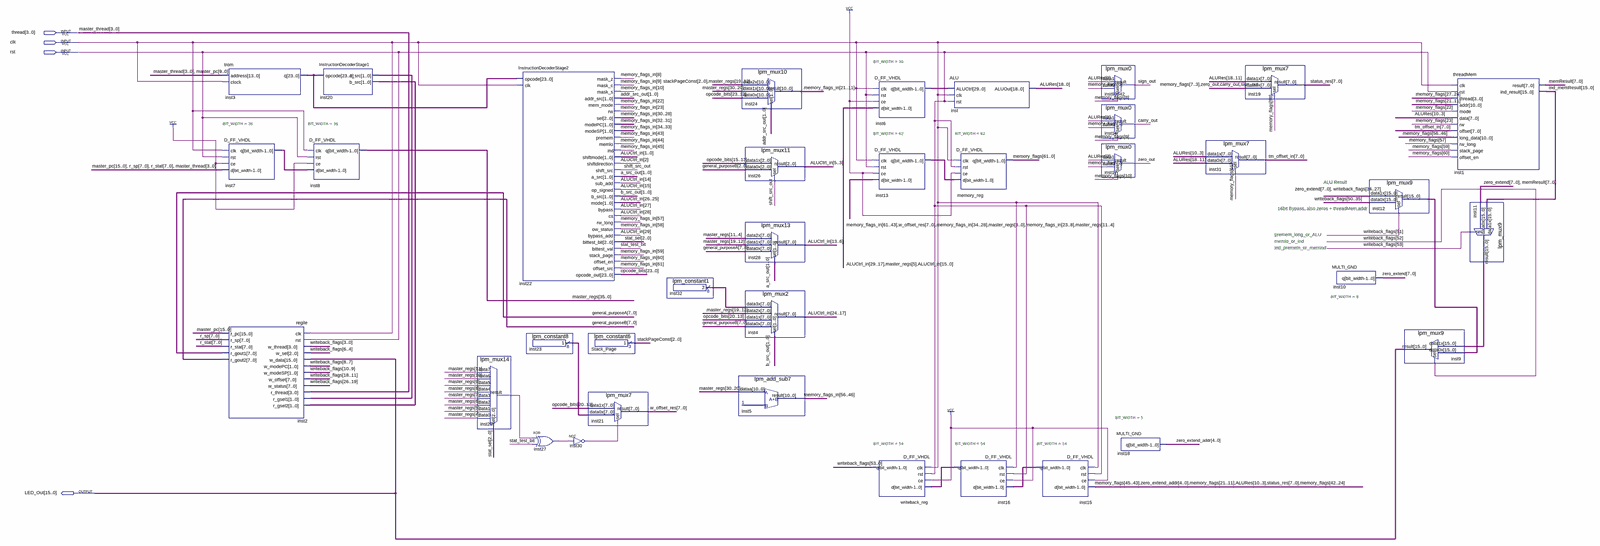
[diagram p0: schematic sheet, whole]
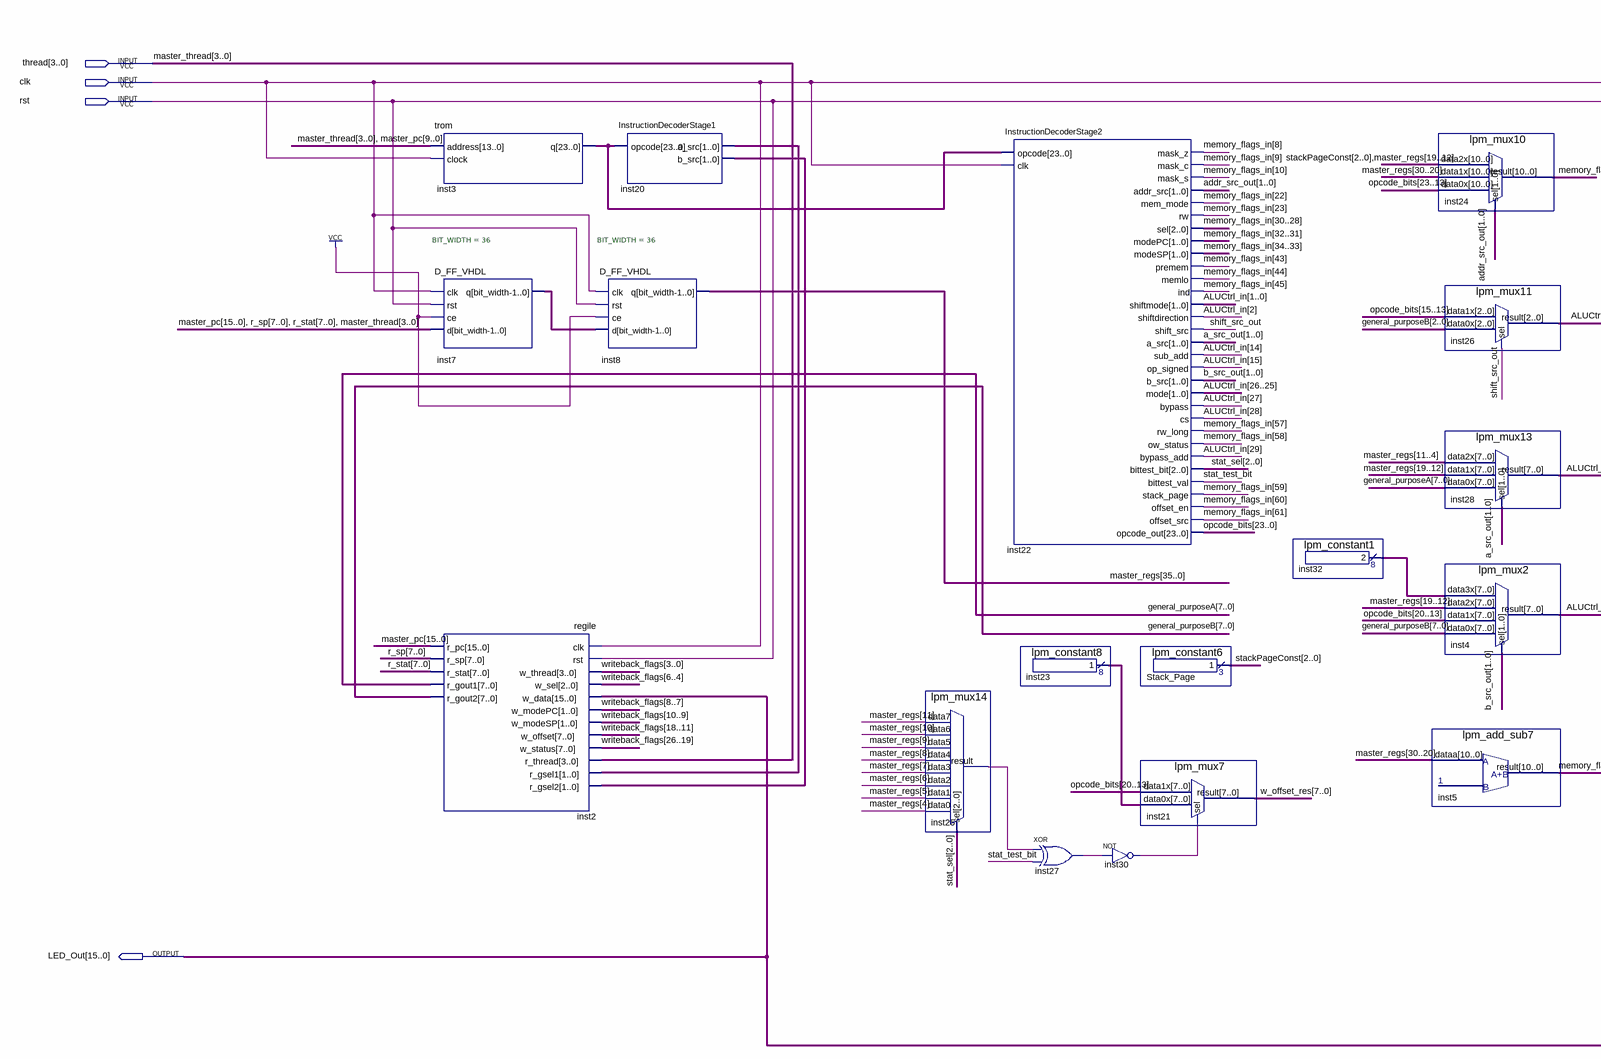
[diagram p1: schematic sheet, left part]
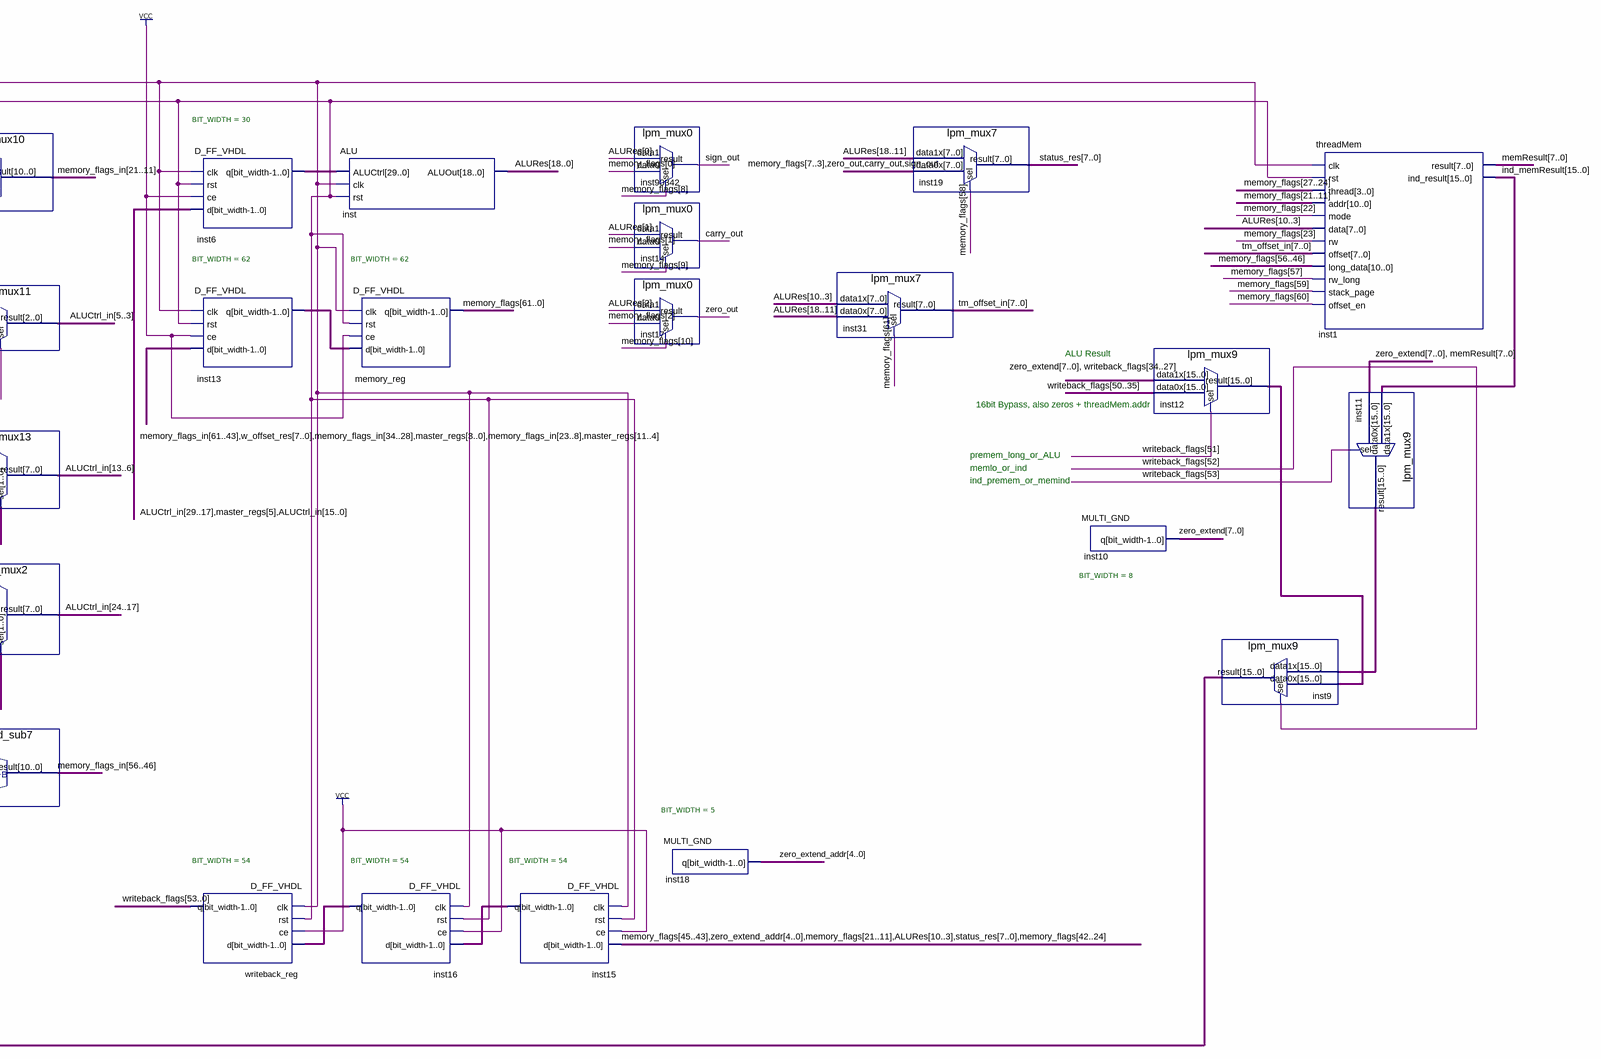
[diagram p2: schematic sheet, right part]
// Quartus schematic core.bdf as structural Verilog: 36 symbols, 4 pins
module core (
  input  [3:0] thread,
  input  clk,
  input  rst,
  output [15:0] LED_Out
);

  wire carry_out, inst25_result, inst27_out, inst30_out, shift_src_out, sign_out, stat_test_bit, zero_out;
  wire [1:0] a_src_out, addr_src_out, b_src_out, inst20_a_src, inst20_b_src;
  wire [2:0] stackPageConst, stat_sel;
  wire [4:0] zero_extend_addr;
  wire [7:0] general_purposeA, general_purposeB, inst23_result, inst32_result, memResult, r_sp, r_stat,
       status_res, tm_offset_in, w_offset_res, zero_extend;
  wire [15:0] ind_memResult, inst11_result, inst12_result, master_pc;
  wire [18:0] ALURes;
  wire [23:0] inst3_q, opcode_bits;
  wire [29:0] ALUCtrl_in, inst6_q;
  wire [35:0] inst7_q, master_regs;
  wire [53:0] inst15_q, inst16_q, writeback_flags;
  wire [61:0] inst13_q, memory_flags;
  wire [61:8] memory_flags_in;

  trom inst3 (.address({thread, master_pc[9:0]}), .clock(clk), .q(inst3_q));
  D_FF_VHDL #(.BIT_WIDTH(36)) inst7 (
    .clk(clk), .rst(rst), .ce(1'b1), .d({master_pc, r_sp, r_stat, thread}), .q(inst7_q));
  regile inst2 (
    .clk(clk), .rst(rst), .w_thread(writeback_flags[3:0]), .w_sel(writeback_flags[6:4]), .w_data(LED_Out),
    .w_modePC(writeback_flags[8:7]), .w_modeSP(writeback_flags[10:9]), .w_offset(writeback_flags[18:11]),
    .w_status(writeback_flags[26:19]), .r_thread(thread), .r_gsel1(inst20_a_src), .r_gsel2(inst20_b_src),
    .r_pc(master_pc), .r_sp(r_sp), .r_stat(r_stat), .r_gout1(general_purposeA), .r_gout2(general_purposeB));
  InstructionDecoderStage1 inst20 (.opcode(inst3_q), .a_src(inst20_a_src), .b_src(inst20_b_src));
  D_FF_VHDL #(.BIT_WIDTH(36)) inst8 (.clk(clk), .rst(rst), .ce(1'b1), .d(inst7_q), .q(master_regs));
  lpm_mux14 inst25 (
    .data7(master_regs[11]), .data6(master_regs[10]), .data5(master_regs[9]), .data4(master_regs[8]),
    .data3(master_regs[7]), .data2(master_regs[6]), .data1(master_regs[5]), .data0(master_regs[4]),
    .sel(stat_sel), .result(inst25_result));
  InstructionDecoderStage2 inst22 (
    .opcode(inst3_q), .clk(clk), .mask_z(memory_flags_in[8]), .mask_c(memory_flags_in[9]),
    .mask_s(memory_flags_in[10]), .addr_src(addr_src_out), .mem_mode(memory_flags_in[22]),
    .rw(memory_flags_in[23]), .sel(memory_flags_in[30:28]), .modePC(memory_flags_in[32:31]),
    .modeSP(memory_flags_in[34:33]), .premem(memory_flags_in[43]), .memlo(memory_flags_in[44]),
    .ind(memory_flags_in[45]), .shiftmode(ALUCtrl_in[1:0]), .shiftdirection(ALUCtrl_in[2]),
    .shift_src(shift_src_out), .a_src(a_src_out), .sub_add(ALUCtrl_in[14]), .op_signed(ALUCtrl_in[15]),
    .b_src(b_src_out), .mode(ALUCtrl_in[26:25]), .bypass(ALUCtrl_in[27]), .cs(ALUCtrl_in[28]),
    .rw_long(memory_flags_in[57]), .ow_status(memory_flags_in[58]), .bypass_add(ALUCtrl_in[29]),
    .bittest_bit(stat_sel), .bittest_val(stat_test_bit), .stack_page(memory_flags_in[59]),
    .offset_en(memory_flags_in[60]), .offset_src(memory_flags_in[61]), .opcode_out(opcode_bits));
  lpm_constant8 inst23 (.result(inst23_result));
  xor inst27 (inst27_out, inst25_result, stat_test_bit);
  lpm_constant6 Stack_Page (.result(stackPageConst));
  lpm_mux7 inst21 (.data1x(opcode_bits[20:13]), .data0x(inst23_result), .sel(inst30_out), .result(w_offset_res));
  not inst30 (inst30_out, inst27_out);
  lpm_constant1 inst32 (.result(inst32_result));
  lpm_mux10 inst24 (
    .data2x({stackPageConst, master_regs[19:12]}), .data1x(master_regs[30:20]), .data0x(opcode_bits[23:13]),
    .sel(addr_src_out), .result(memory_flags_in[21:11]));
  lpm_mux11 inst26 (
    .data1x(opcode_bits[15:13]), .data0x(general_purposeB[2:0]), .sel(shift_src_out), .result(ALUCtrl_in[5:3]));
  lpm_mux13 inst28 (
    .data2x(master_regs[11:4]), .data1x(master_regs[19:12]), .data0x(general_purposeA), .sel(a_src_out),
    .result(ALUCtrl_in[13:6]));
  lpm_mux2 inst4 (
    .data3x(inst32_result), .data2x(master_regs[19:12]), .data1x(opcode_bits[20:13]),
    .data0x(general_purposeB), .sel(b_src_out), .result(ALUCtrl_in[24:17]));
  lpm_add_sub7 inst5 (.dataa(master_regs[30:20]), .result(memory_flags_in[56:46]));
  D_FF_VHDL #(.BIT_WIDTH(30)) inst6 (
    .clk(clk), .rst(rst), .ce(1'b1), .d({ALUCtrl_in[29:17], master_regs[5], ALUCtrl_in[15:0]}), .q(inst6_q));
  D_FF_VHDL #(.BIT_WIDTH(62)) inst13 (
    .clk(clk), .rst(rst), .ce(1'b1),
    .d({memory_flags_in[61:43], w_offset_res, memory_flags_in[34:28], master_regs[3:0], memory_flags_in[23:8], master_regs[11:4]}),
    .q(inst13_q));
  D_FF_VHDL #(.BIT_WIDTH(54)) writeback_reg (.clk(clk), .rst(rst), .ce(1'b1), .d(inst16_q), .q(writeback_flags));
  ALU inst (.ALUCtrl(inst6_q), .clk(clk), .rst(rst), .ALUOut(ALURes));
  D_FF_VHDL #(.BIT_WIDTH(62)) memory_reg (.clk(clk), .rst(rst), .ce(1'b1), .d(inst13_q), .q(memory_flags));
  D_FF_VHDL #(.BIT_WIDTH(54)) inst16 (.clk(clk), .rst(rst), .ce(1'b1), .d(inst15_q), .q(inst16_q));
  D_FF_VHDL #(.BIT_WIDTH(54)) inst15 (
    .clk(clk), .rst(rst), .ce(1'b1),
    .d({memory_flags[45:43], zero_extend_addr, memory_flags[21:11], ALURes[10:3], status_res, memory_flags[42:24]}),
    .q(inst15_q));
  lpm_mux0 inst90342 (.data1(ALURes[0]), .data0(memory_flags[0]), .sel(memory_flags[8]), .result(sign_out));
  lpm_mux0 inst14 (.data1(ALURes[1]), .data0(memory_flags[1]), .sel(memory_flags[9]), .result(carry_out));
  lpm_mux0 inst17 (.data1(ALURes[2]), .data0(memory_flags[2]), .sel(memory_flags[10]), .result(zero_out));
  MULTI_GND #(.BIT_WIDTH(5)) inst18 (.q(zero_extend_addr));
  lpm_mux7 inst31 (.data1x(ALURes[10:3]), .data0x(ALURes[18:11]), .sel(memory_flags[61]), .result(tm_offset_in));
  lpm_mux7 inst19 (
    .data1x(ALURes[18:11]), .data0x({memory_flags[7:3], zero_out, carry_out, sign_out}),
    .sel(memory_flags[58]), .result(status_res));
  MULTI_GND #(.BIT_WIDTH(8)) inst10 (.q(zero_extend));
  lpm_mux9 inst12 (
    .data1x({zero_extend, writeback_flags[34:27]}), .data0x(writeback_flags[50:35]),
    .sel(writeback_flags[51]), .result(inst12_result));
  lpm_mux9 inst9 (.data1x(inst11_result), .data0x(inst12_result), .sel(writeback_flags[52]), .result(LED_Out));
  threadMem inst1 (
    .clk(clk), .rst(rst), .thread(memory_flags[27:24]), .addr(memory_flags[21:11]), .mode(memory_flags[22]),
    .data(ALURes[10:3]), .rw(memory_flags[23]), .offset(tm_offset_in), .long_data(memory_flags[56:46]),
    .rw_long(memory_flags[57]), .stack_page(memory_flags[59]), .offset_en(memory_flags[60]),
    .result(memResult), .ind_result(ind_memResult));
  lpm_mux9 inst11 (
    .data1x(ind_memResult), .data0x({zero_extend, memResult}), .sel(writeback_flags[53]),
    .result(inst11_result));

  // Other names for the same wires on the sheet: master_thread[3:0] = thread

  // Notes on the sheet:
  //   ALU Result
  //   16bit Bypass, also zeros + threadMem.addr
  //   premem_long_or_ALU
  //   memlo_or_ind
  //   ind_premem_or_memind
endmodule
